# EAGLE design LVDS (EAGLE 7.2.0)
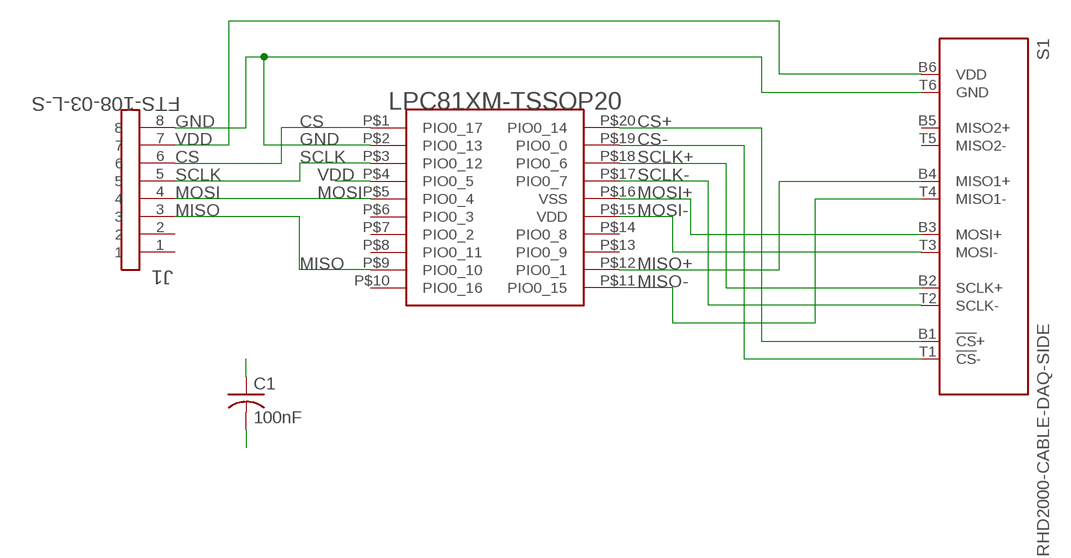
[diagram p0: schematic, sheet 1]

## Parts
C1  100nF  C-USC0402  [C0402]
J1  FTS-108-03-L-S  [SAMTEC_FTS-108-03-S]
LVDS  LPC81XM_TSSOP20  [TSSOP20]
S1  RHD2000-CABLE-DAQ-SIDE  [OMNETICS_PZN-12-AA]

## Nets
CS: J1.6 LVDS.P$1(PIO0_17)
CS+: LVDS.P$20(PIO0_14) S1.B1(!CS!+)
CS-: LVDS.P$19(PIO0_0) S1.T1(!CS!-)
GND: C1.2 J1.8 LVDS.P$2(PIO0_13) S1.T6(GND)
MISO: J1.3 LVDS.P$9(PIO0_10)
MISO+: LVDS.P$12(PIO0_1) S1.B4(MISO1+)
MISO-: LVDS.P$11(PIO0_15) S1.T4(MISO1-)
MOSI: J1.4 LVDS.P$5(PIO0_4)
MOSI+: LVDS.P$16(VSS) S1.B3(MOSI+)
MOSI-: LVDS.P$15(VDD) S1.T3(MOSI-)
SCLK: J1.5 LVDS.P$3(PIO0_12)
SCLK+: LVDS.P$18(PIO0_6) S1.B2(SCLK+)
SCLK-: LVDS.P$17(PIO0_7) S1.T2(SCLK-)
VDD: C1.1 J1.7 LVDS.P$4(PIO0_5) S1.B6(VDD)
Unconnected: J1.1 J1.2 LVDS.P$6(PIO0_3) LVDS.P$7(PIO0_2) LVDS.P$8(PIO0_11) LVDS.P$10(PIO0_16) LVDS.P$13(PIO0_9) LVDS.P$14(PIO0_8) S1.B5(MISO2+) S1.T5(MISO2-)

## Library data of the parts
C1 = rcl:C-US: CAPACITOR, American symbol
J1 = samtec_fts:FTS-108-03-L-S: CONN HEADER, 1.27MM, VERTICAL THT, 16WAY; MPN: FTS-108-03-L-D; OC_FARNELL: 1929684; OC_NEWARK: 11P4665; PACKAGE: HEADER, 1.27MM, VERTICAL THT, 16WAY; SUPPLIER: Samtec
LVDS = LPC81XM:LPC81XM_TSSOP20
S1 = RHD2000:RHD2000-CABLE-DAQ-SIDE: Omnetics A79623 PZN-12-AA connector for SPI interface (controller side)

## Board
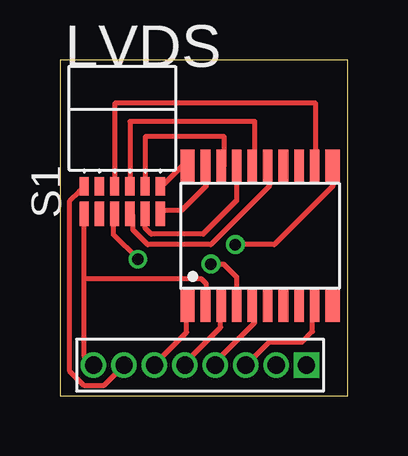
[diagram p1: board, top side]
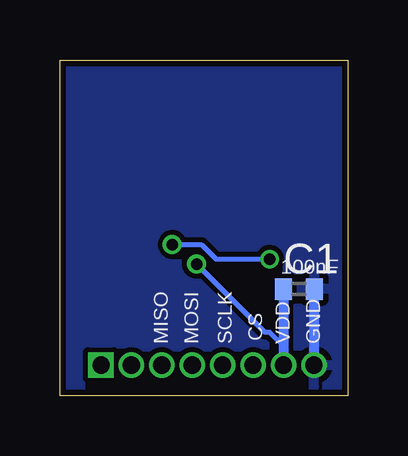
[diagram p2: board, bottom side, seen from below]

Size 12 x 14 mm. Coordinates in mm from the lower left corner, seen from the top.
Outline: 0,0 12,0 12,14 0,14 0,0
Copper layers (1*16): Top 0.035mm / dielectric 1.5mm / Bottom 0.035mm
Design rules "MF_Standard_2_Layer *": minimum track width 8mil, minimum drill 19mil, track to track 8mil, track to pad 8mil, pad to pad 8mil, via to via 8mil, smd to smd 0mil, copper to edge 10mil, drill to drill 10mil, minimum pad ring 6mil, minimum via ring 6mil, stop-mask expansion 2mil, vias tented up to drill 25mil, thermal gap 10mil

### Footprints (pad centres in the part's own frame; a part is rotated, then mirrored left to right if it is on the bottom)
C0402 = smd 0.7 x 0.9: 1 -0.65,0; 2 0.65,0
SAMTEC_FTS-108-03-S = drill 0.711 square: 1 0,0 | drill 0.711: 2 1.27,0; 3 2.54,0; 4 3.81,0; 5 5.08,0; 6 6.35,0; 7 7.62,0; 8 8.89,0
TSSOP20 = smd 0.6 x 1.35: P$1 -3.025,-2.925; P$10 3.025,-2.925; P$11 3.025,2.925; P$20 -3.025,2.925 | smd 0.4 x 1.35: P$2 -2.275,-2.925; P$3 -1.625,-2.925; P$4 -0.975,-2.925; P$5 -0.325,-2.925; P$6 0.325,-2.925; P$7 0.975,-2.925; P$8 1.625,-2.925; P$9 2.275,-2.925; P$12 2.275,2.925; P$13 1.625,2.925; P$14 0.975,2.925; P$15 0.325,2.925; P$16 -0.325,2.925; P$17 -0.975,2.925; P$18 -1.625,2.925; P$19 -2.275,2.925
OMNETICS_PZN-12-AA = smd 0.381 x 0.762: B1 1.587,-1.016; B2 0.953,-1.016; B3 0.318,-1.016; B4 -0.318,-1.016; B5 -0.953,-1.016; B6 -1.587,-1.016 | smd 0.381 x 1.016: T1 1.587,-2.159; T2 0.953,-2.159; T3 0.318,-2.159; T4 -0.318,-2.159; T5 -0.953,-2.159; T6 -1.587,-2.159

### Placement (x,y rotation side)
C1  2.03,4.45 0 bottom
J1  10.29,1.27 180 top
LVDS  8.35,6.66 0 top
S1  2.6,9.75 0 top

### Tracks (layer width: path | path; a pad name or v marks a point on that pad's centre or on a via)
CS
  Top 0.203: LVDS.P$1 5.28,3.66 5.28,2.64 4.06,1.42 J1.6
CS+
  Top 0.203: S1.B1 4.27,8.74 5.28,9.75 LVDS.P$20
CS-
  Top 0.203: S1.T1 4.27,7.72 5.08,7.72 6.1,8.74 6.1,9.55 LVDS.P$19
GND
  Top 0.203: 1.02,4.88 1.02,1.63 1.22,1.42 J1.8 | 1.02,4.88 1.02,7.52 S1.T6 | 1.02,4.88 5.89,4.88 6.1,4.67 6.1,3.86 LVDS.P$2
  Bottom 0.406: C1.2 1.4,4.06 J1.8
  pour Bottom: 0,14 0,-0.1 12.1,-0.1 12.1,0 12,0 12,14
MISO
  Top 0.203: J1.3 7.92,1.42 8.74,2.23 10.11,2.23 10.54,2.67 10.54,3.66 LVDS.P$9
MISO+
  Top 0.203: S1.B4 2.28,12.19 10.67,12.19 10.67,10.29 10.67,9.64 | 10.67,9.59 10.67,9.64 | 10.67,9.64 LVDS.P$12
MISO-  (via drill 0.48)
  Top 0.203: v3.25,5.69 2.23,6.71 2.23,7.52 S1.T4 | v7.32,6.3 8.94,6.3 11.38,8.74 11.38,9.55 LVDS.P$11
  Bottom 0.203: v3.25,5.69 5.49,5.69 6.1,6.3 v7.32,6.3
MOSI
  Top 0.203: LVDS.P$5 8.13,3.66 8.13,3.05 6.5,1.42 J1.4
MOSI+
  Top 0.203: LVDS.P$16 8.13,9.59 8.13,11.43 2.92,11.43 S1.B3
MOSI-
  Top 0.203: S1.T3 3.05,7.52 3.05,6.91 3.66,6.3 6.3,6.3 8.74,8.74 8.74,9.55 LVDS.P$15
SCLK
  Top 0.203: LVDS.P$3 6.71,3.66 6.71,2.85 5.28,1.42 J1.5
SCLK+
  Top 0.203: LVDS.P$18 6.86,9.59 6.86,10.79 3.55,10.79 S1.B2
SCLK-
  Top 0.203: LVDS.P$17 7.37,8.13 5.97,6.73 3.81,6.73 3.56,6.99 S1.T2
VDD  (via drill 0.48)
  Top 0.203: S1.B6 1.02,8.53 0.81,8.53 0.41,8.13 0.41,1.02 1.02,0.41 1.83,0.41 2.64,1.22 J1.7 | v6.3,5.49 6.83,5.49 7.37,4.95 LVDS.P$4
  Bottom 0.203: v6.3,5.49 3.45,2.64 3.25,2.64 2.64,2.03 2.64,1.42 J1.7
  Bottom 0.406: C1.1 2.67,4.06 J1.7

### Text on the board
bPlace: 100nF | GND | VDD | CS | SCLK | MOSI | MISO
tNames: LVDS